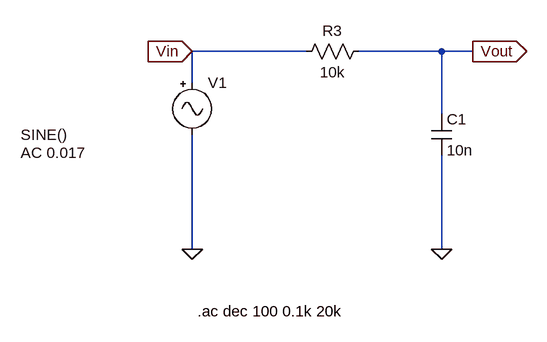
[diagram p0: schematic Detector_Radio_Transistor_Low_Pass_Filter_final.asc]
Detector_Radio_Transistor_Low_Pass_Filter_final.asc, the LTspice schematic file:
Version 4
SHEET 1 880 680
WIRE -304 32 -480 32
WIRE -96 32 -224 32
WIRE -48 32 -96 32
WIRE -480 80 -480 32
WIRE -96 128 -96 32
WIRE -480 336 -480 160
WIRE -96 336 -96 192
FLAG -96 336 0
FLAG -480 336 0
FLAG -480 32 Vin
IOPIN -480 32 In
FLAG -48 32 Vout
IOPIN -48 32 Out
SYMBOL Misc\\signal -480 64 R0
WINDOW 123 -264 124 Left 2
WINDOW 39 0 0 Left 0
WINDOW 3 -264 96 Left 2
SYMATTR Value2 AC 0.017
SYMATTR Value SINE()
SYMATTR InstName V1
SYMBOL res -208 16 R90
WINDOW 0 0 56 VBottom 2
WINDOW 3 32 56 VTop 2
SYMATTR InstName R3
SYMATTR Value 10k
SYMBOL cap -112 128 R0
SYMATTR InstName C1
SYMATTR Value 10n
TEXT -472 432 Left 2 !.ac dec 100 0.1k 20k

The netlist it stands for:
* Detector_Radio_Transistor_Low_Pass_Filter_final.asc
V1 Vin 0 SINE() AC 0.017
R3 Vout Vin 10k
C1 Vout 0 10n
.ac dec 100 0.1k 20k
.backanno
.end